# EAGLE schematic ControllerBoard (EAGLE 4.16)
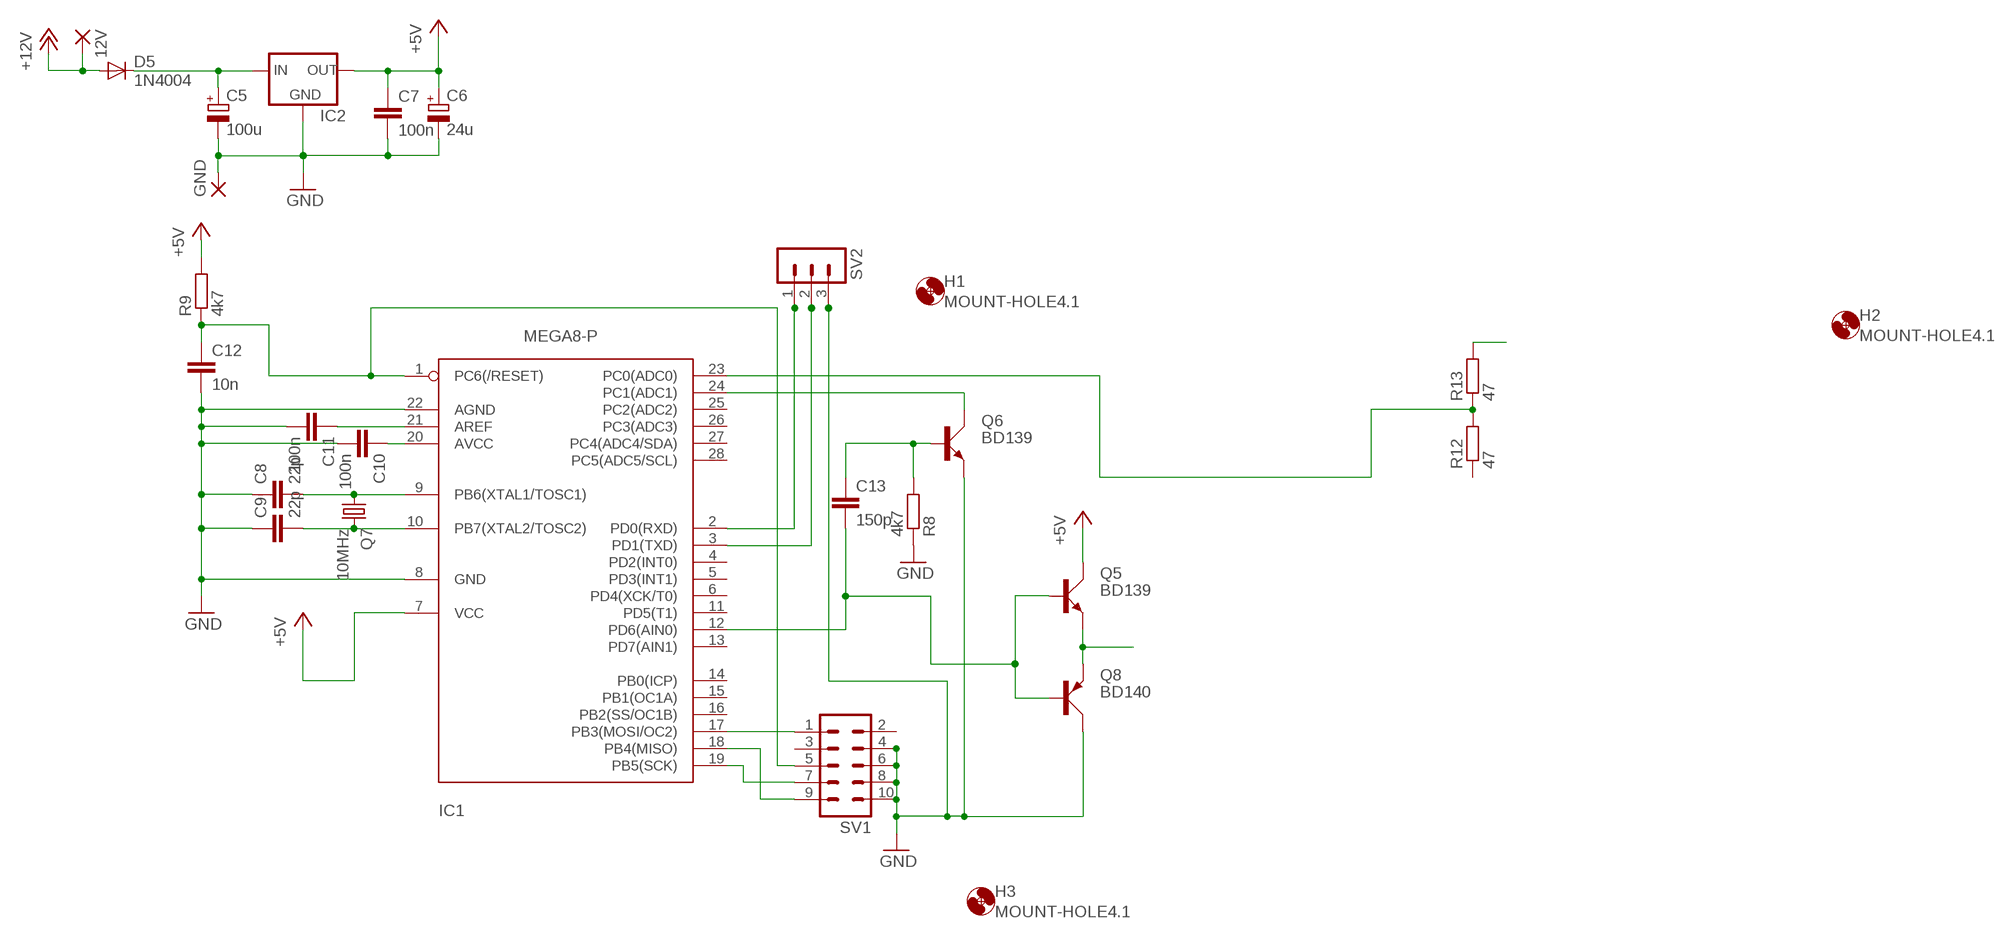
[diagram p0: schematic, sheet 1]

## Parts
12V  3,81/1,4  [3,81/1,4]
C5  100u  CPOL-EUE2.5-5  [E2,5-5]
C6  24u  CPOL-EUE2.5-5  [E2,5-5]
C7  100n  C-EU025_050-045X075  [C025_050-045X075]
C8  22p  C-EU025_050-045X075  [C025_050-045X075]
C9  22p  C-EU025_050-045X075  [C025_050-045X075]
C10  100n  C-EU025_050-045X075  [C025_050-045X075]
C11  100n  C-EU025_050-045X075  [C025_050-045X075]
C12  10n  C-EU025_050-045X075  [C025_050-045X075]
C13  150p  C-EU025_050-045X075  [C025_050-045X075]
D5  1N4004  [DO41-10]
GND  3,81/1,4  [3,81/1,4]
H1  MOUNT-HOLE4.1  [4,1]
H2  MOUNT-HOLE4.1  [4,1]
H3  MOUNT-HOLE4.1  [4,1]
IC1  MEGA8-P  [DIL28-3]
IC2  78XXL  [78XXL]
Q5  BD139  [TO126AV]
Q6  BD139  [TO126AV]
Q7  10MHz  CRYSTALHC49S  [HC49/S]
Q8  BD140  [TO126AV]
R8  4k7  R-EU_0207/10  [0207/10]
R9  4k7  R-EU_0207/10  [0207/10]
R12  47  R-EU_0207/10  [0207/10]
R13  47  R-EU_0207/10  [0207/10]
SV1  MA05-2  [MA05-2]
SV2  MA03-1  [MA03-1]

## Nets
+5V: C6.+ C7.1 IC1.7(VCC) IC2.OUT Q5.C R9.2
+12V: 12V.1(P) D5.A
GND: C5.- C6.- C7.2 C8.1 C9.1 C10.2 C11.2 C12.2 GND.1(P) IC1.8(GND) IC1.22(AGND) IC2.GND Q6.E Q8.C R8.1 SV1.4 SV1.6 SV1.8 SV1.10 SV2.3
N$1: Q5.E Q8.E
N$2: IC1.24(PC1(ADC1)) Q6.C
N$4: C13.1 Q6.B R8.2
N$5: C10.1 IC1.20(AVCC)
N$6: C11.1 IC1.21(AREF)
N$12: C8.2 IC1.9(PB6(XTAL1/TOSC1)) Q7.1
N$13: C13.2 IC1.12(PD6(AIN0)) Q5.B Q8.B
N$14: C9.2 IC1.10(PB7(XTAL2/TOSC2)) Q7.2
N$16: IC1.2(PD0(RXD)) SV2.1
N$17: C5.+ D5.C IC2.IN
N$19: IC1.3(PD1(TXD)) SV2.2
N$20: IC1.17(PB3(MOSI/OC2)) SV1.1
N$21: IC1.19(PB5(SCK)) SV1.7
N$22: IC1.18(PB4(MISO)) SV1.9
N$24: R13.2
N$25: C12.1 IC1.1(PC6(/RESET)) R9.1 SV1.5
N$26: IC1.23(PC0(ADC0)) R12.2 R13.1
Unconnected: IC1.4(PD2(INT0)) IC1.5(PD3(INT1)) IC1.6(PD4(XCK/T0)) IC1.11(PD5(T1)) IC1.13(PD7(AIN1)) IC1.14(PB0(ICP)) IC1.15(PB1(OC1A)) IC1.16(PB2(SS/OC1B)) IC1.25(PC2(ADC2)) IC1.26(PC3(ADC3)) IC1.27(PC4(ADC4/SDA)) IC1.28(PC5(ADC5/SCL)) R12.1 SV1.2 SV1.3

## Library data of the parts
12V GND = wirepad:3,81/1,4: THROUGH-HOLE PAD
C5 C6 = rcl:CPOL-EU: POLARIZED CAPACITOR, European symbol
C7-C13 = rcl:C-EU: CAPACITOR, European symbol
D5 = diode:1N4004: DIODE general purpose rectifier, 1 A
H1-H3 = holes:MOUNT-HOLE: MOUNTING HOLE with drill center marker
IC1 = atmel:MEGA8-P: MICROCONTROLLER 8 Kbytes FLASH 1 kbytes SRAM 512 bytes EEPROM USART 4-channel 10 bit ADC 2-channel 8 bit ADC Source: avr.lbr
IC2 = v-reg:78XXL: VOLTAGE REGULATOR
Q5 Q6 = transistor-power:BD139: NPN TRANSISTOR
Q7 = crystal:CRYSTAL: CRYSTAL
Q8 = transistor-power:BD140: PNP TRANSISTOR
R8 R9 R12 R13 = rcl:R-EU_: RESISTOR, European symbol
SV1 = con-lstb:MA05-2: PIN HEADER
SV2 = con-lstb:MA03-1: PIN HEADER